# EAGLE design gunes_paneli (EAGLE 8.5.1)
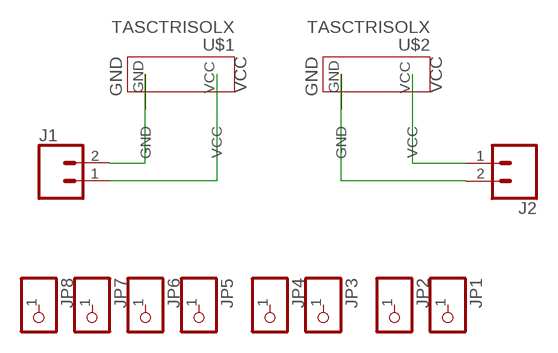
[diagram p0: schematic, sheet 1]

## Parts
J1  CONN_02  [1X02]
J2  CONN_02  [1X02]
JP1  PINHD-1X1CB  [1X01-CLEANBIG]
JP2  PINHD-1X1CB  [1X01-CLEANBIG]
JP3  PINHD-1X1CB  [1X01-CLEANBIG]
JP4  PINHD-1X1CB  [1X01-CLEANBIG]
JP5  PINHD-1X1CB  [1X01-CLEANBIG]
JP6  PINHD-1X1CB  [1X01-CLEANBIG]
JP7  PINHD-1X1CB  [1X01-CLEANBIG]
JP8  PINHD-1X1CB  [1X01-CLEANBIG]
U$1  TASCTRISOLX  [TASCTRİSOLX]
U$2  TASCTRISOLX  [TASCTRİSOLX]

## Nets
N$1: J1.2 U$1.GND
N$2: J1.1 U$1.VCC
N$3: J2.1 U$2.VCC
N$4: J2.2 U$2.GND
Unconnected: JP1.1 JP2.1 JP3.1 JP4.1 JP5.1 JP6.1 JP7.1 JP8.1

## Library data of the parts
J1 J2 = SparkFun-Connectors:CONN_02: Multi connection point. Often used as Generic Header-pin footprint for 0.1 inch spaced/style header connections On any of the 0.1 inch spaced packages, you can populate with these: Break Away Headers - Straight <https://www.sparkfun.com/products/116> (PRT-00116) Break Away Male Headers - Right Angle <https://www.sparkfun.com/products/553> (PRT-00553) Female Headers <https://www.sparkfun.com/products/115> (PRT-00115) Break Away Headers - Machine Pin <https://www.sparkfun.com/products/117> (PRT-00117) Break Away Female Headers - Swiss Machine Pin <https://www.sparkfun.com/products/743> (PRT-00743) For SCREWTERMINALS and SPRING TERMINALS visit here: Screw Terimnals on SparkFun.com <https://www.sparkfun.com/search/results?term=Screw+Terminals> (5mm/3.5mm/2.54mm spacing) This device is also useful as a general connection point to wire up your design to another part of your project. Our various solder wires solder well into these plated through hole pads. Hook-Up Wire - Assortment (Stranded, 22 AWG) <https://www.sparkfun.com/products/11375> (PRT-11375) Hook-Up Wire - Assortment (Solid Core, 22 AWG) <https://www.sparkfun.com/products/11367> (PRT-11367) View the entire wire category on our website here <https://www.sparkfun.com/categories/141> Special notes: Molex polarized connector foot print use with: PRT-08233 with associated crimp pins and housings. 2.54_SCREWTERM for use with PRT-10571. 3.5mm Screw Terminal footprints for PRT-08084 5mm Screw Terminal footprints for use with PRT-08432
JP1-JP8 = adafruit:PINHD-1X1: Pin header 1x1 for 0.1" spacing With round pins
U$1 U$2 = 0000000111111aaa:TASCTRISOLX

## Board
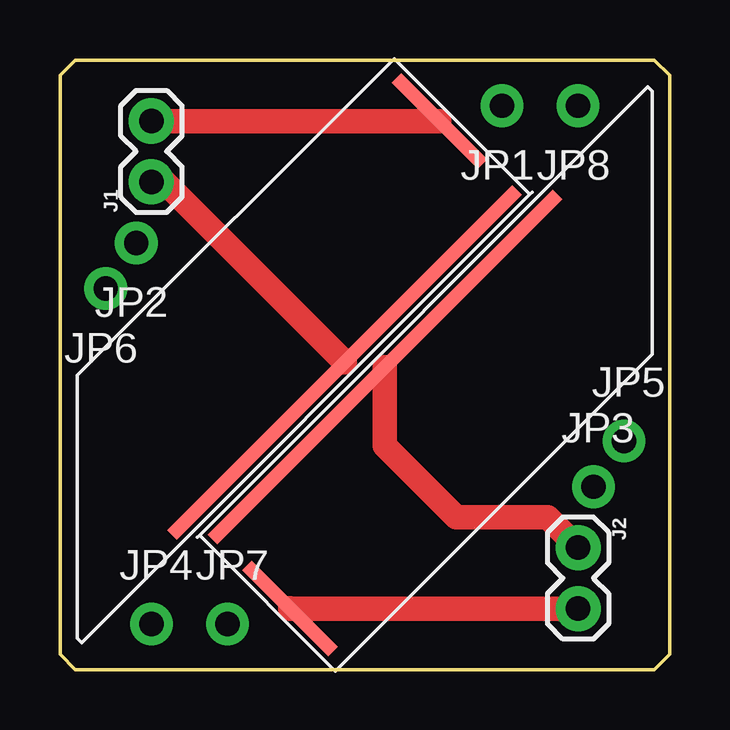
[diagram p1: board, top side]

Size 25.4 x 25.4 mm. Coordinates in mm from the lower left corner, seen from the top.
Outline: 0,24.77 0.64,25.4 24.77,25.4 25.4,24.77 25.4,0.64 24.77,0 0.64,0 0,0.64 0,24.77
Copper layers (1*16): Top 0.035mm / dielectric 1.5mm / Bottom 0.035mm
Design rules "default": minimum track width 6mil, minimum drill 0.35mm, track to track 6mil, track to pad 6mil, pad to pad 6mil, via to via 6mil, smd to smd 6mil, copper to edge 40mil, drill to drill 6mil, minimum pad ring 10mil, minimum via ring 8mil, stop-mask expansion 4mil, vias tented up to drill 0mil, thermal gap 10mil

### Footprints (pad centres in the part's own frame; a part is rotated, then mirrored left to right if it is on the bottom)
1X02 = drill 1.016 pad 1.88: 1 0,0; 2 2.54,0
1X01-CLEANBIG = drill 1.016 pad 1.778: 1 0,0
TASCTRİSOLX = smd 0.559 x 5.08: GND -11.176,-2.286 | smd 20.32 x 0.559: VCC -1.27,2.032

### Placement (x,y rotation side)
J1  3.81,20.32 90 top
J2  21.59,5.08 270 top
JP1  18.42,23.5 180 top
JP2  3.17,17.78 180 top
JP3  22.23,7.62 0 top
JP4  3.81,1.91 0 top
JP5  23.5,9.53 0 top
JP6  1.91,15.88 180 top
JP7  6.98,1.91 0 top
JP8  21.59,23.5 180 top
U$1  9.53,13.34 225 top
U$2  15.88,12.07 45 top

### Tracks (layer width: path | path; a pad name or v marks a point on that pad's centre or on a via)
N$1
  Top 1.016: J1.2 3.82,22.85 U$1.GND
N$2
  Top 1.016: U$1.VCC 4.34,20.32 J1.1
N$3
  Top 1.016: J2.1 20.32,6.35 16.51,6.35 13.54,9.32 U$2.VCC
N$4
  Top 1.016: J2.2 U$2.GND